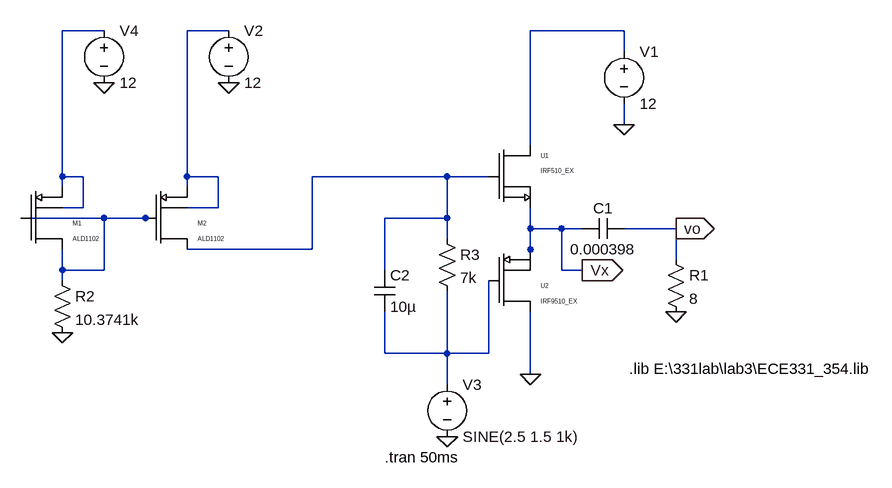
[diagram p0: schematic lab3_2.asc]
lab3_2.asc, the LTspice schematic file:
Version 4
SHEET 1 880 680
WIRE -1184 -464 -1248 -464
WIRE -992 -464 -1056 -464
WIRE -384 -464 -528 -464
WIRE -384 -432 -384 -464
WIRE -384 -320 -384 -352
WIRE -528 -288 -528 -464
WIRE -1248 -240 -1248 -464
WIRE -1216 -240 -1248 -240
WIRE -1056 -240 -1056 -464
WIRE -1008 -240 -1056 -240
WIRE -656 -240 -864 -240
WIRE -592 -240 -656 -240
WIRE -1248 -224 -1248 -240
WIRE -1056 -224 -1056 -240
WIRE -1216 -192 -1216 -240
WIRE -1216 -192 -1248 -192
WIRE -1008 -192 -1008 -240
WIRE -1008 -192 -1056 -192
WIRE -1184 -176 -1312 -176
WIRE -1120 -176 -1184 -176
WIRE -1104 -176 -1120 -176
WIRE -656 -176 -656 -240
WIRE -656 -176 -752 -176
WIRE -528 -160 -528 -192
WIRE -480 -160 -528 -160
WIRE -448 -160 -480 -160
WIRE -304 -160 -384 -160
WIRE -656 -144 -656 -176
WIRE -864 -128 -864 -240
WIRE -864 -128 -1056 -128
WIRE -528 -128 -528 -160
WIRE -528 -112 -528 -128
WIRE -304 -112 -304 -160
WIRE -1248 -96 -1248 -128
WIRE -1184 -96 -1184 -176
WIRE -1184 -96 -1248 -96
WIRE -752 -96 -752 -176
WIRE -480 -96 -480 -160
WIRE -448 -96 -480 -96
WIRE -1248 -80 -1248 -96
WIRE -752 32 -752 -32
WIRE -656 32 -656 -64
WIRE -656 32 -752 32
WIRE -592 32 -592 -80
WIRE -592 32 -656 32
WIRE -528 64 -528 -32
WIRE -656 80 -656 32
FLAG -384 -320 0
FLAG -528 64 0
FLAG -304 -32 0
FLAG -304 -160 vo
IOPIN -304 -160 Out
FLAG -448 -96 Vx
IOPIN -448 -96 Out
FLAG -1248 0 0
FLAG -992 -384 0
FLAG -656 160 0
FLAG -1184 -384 0
SYMBOL IRF510 -592 -288 R0
SYMATTR InstName U1
SYMBOL IRF9510 -592 -128 R0
SYMATTR InstName U2
SYMBOL voltage -384 -448 R0
WINDOW 123 0 0 Left 2
WINDOW 39 0 0 Left 2
SYMATTR InstName V1
SYMATTR Value 12
SYMBOL cap -384 -176 R90
WINDOW 0 0 32 VBottom 2
WINDOW 3 32 32 VTop 2
SYMATTR InstName C1
SYMATTR Value 0.000398
SYMBOL res -320 -128 R0
SYMATTR InstName R1
SYMATTR Value 8
SYMBOL ALD1102 -1120 -224 R0
SYMATTR InstName M2
SYMBOL ALD1102 -1312 -224 R0
SYMATTR InstName M1
SYMBOL res -1264 -96 R0
SYMATTR InstName R2
SYMATTR Value 10.3741k
SYMBOL voltage -992 -480 R0
WINDOW 123 0 0 Left 2
WINDOW 39 0 0 Left 2
SYMATTR InstName V2
SYMATTR Value 12
SYMBOL res -672 -160 R0
SYMATTR InstName R3
SYMATTR Value 7k
SYMBOL cap -768 -96 R0
SYMATTR InstName C2
SYMATTR Value 10µ
SYMBOL voltage -656 64 R0
WINDOW 123 0 0 Left 2
WINDOW 39 0 0 Left 2
SYMATTR InstName V3
SYMATTR Value SINE(2.5 1.5 1k)
SYMBOL voltage -1184 -480 R0
WINDOW 123 0 0 Left 2
WINDOW 39 0 0 Left 2
SYMATTR InstName V4
SYMATTR Value 12
TEXT -752 192 Left 2 !.tran 50ms
TEXT -376 56 Left 2 !.lib E:\\331lab\\lab3\\ECE331_354.lib

The netlist it stands for:
* lab3_2.asc
XU1 N003 N004 Vx IRF510_EX  ; pins D G S
XU2 0 N006 Vx IRF9510_EX  ; pins D G S
V1 N003 0 12
C1 vo Vx 0.000398
R1 vo 0 8
M2 N004 N005 N002 N002 ALD1102 W=1.739e-3 L=1e-6
M1 N005 N005 N001 N001 ALD1102 W=1.739e-3 L=1e-6
R2 N005 0 10.3741k
V2 N002 0 12
R3 N004 N006 7k
C2 N004 N006 10µ
V3 N006 0 SINE(2.5 1.5 1k)
V4 N001 0 12
.model NMOS NMOS
.model PMOS PMOS
.lib standard.mos
.tran 50ms
.lib E:\331lab\lab3\ECE331_354.lib
.backanno
.end